# EAGLE schematic Cinesense (EAGLE 9.6.2)
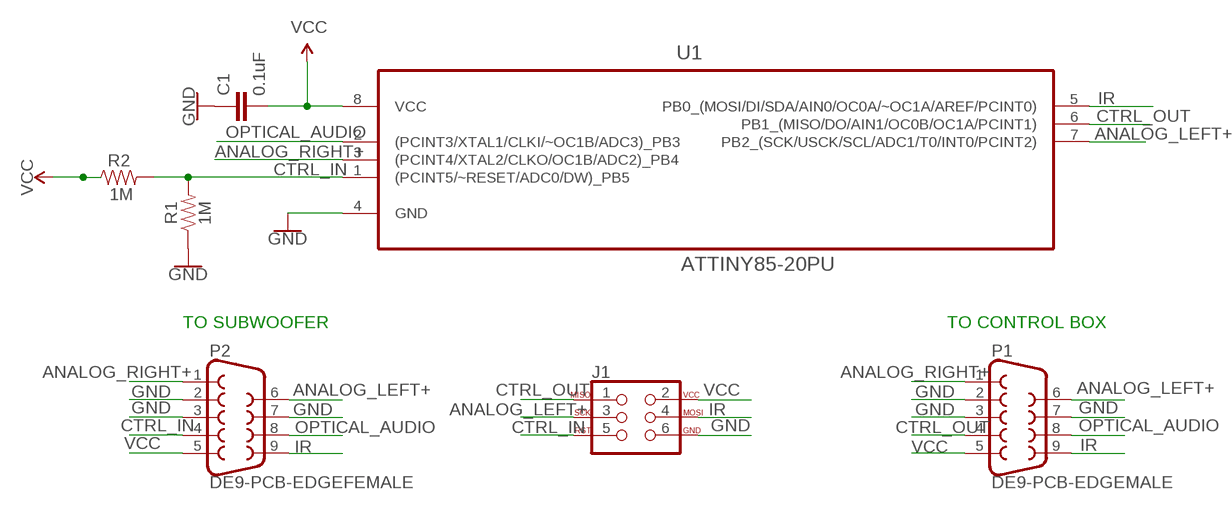
[diagram p0: schematic, sheet 1]

## Parts
C1  0.1uF  0.1UF-KIT-EZ-50V-20%  [CAP-PTH-SMALL-KIT]
J1  AVR_SPI_PROG_3X2PTH  [2X3]
P1  DE9-PCB-EDGEMALE  [DE9-EDGE-M]
P2  DE9-PCB-EDGEFEMALE  [DE9-EDGE-F]
R1  1M  RESISTORAXIAL-0.3  [AXIAL-0.3]
R2  1M  RESISTORAXIAL-0.3  [AXIAL-0.3]
U1  ATTINY85-20PU  [DIP254P762X533-8]

## Nets
ANALOG_LEFT+: J1.3 P1.6 P2.6 U1.7(PB2_(SCK/USCK/SCL/ADC1/T0/INT0/PCINT2))
ANALOG_RIGHT+: P1.1 P2.1 U1.3((PCINT4/XTAL2/CLKO/OC1B/ADC2)_PB4)
CTRL_IN: J1.5 P2.4 R1.P$2 R2.P$2 U1.1((PCINT5/~RESET/ADC0/DW)_PB5)
CTRL_OUT: J1.1 P1.4 U1.6(PB1_(MISO/DO/AIN1/OC0B/OC1A/PCINT1))
GND: C1.1 J1.6 P1.2 P1.3 P1.7 P2.2 P2.3 P2.7 R1.P$1 U1.4(GND)
IR: J1.4 P1.9 P2.9 U1.5(PB0_(MOSI/DI/SDA/AIN0/OC0A/~OC1A/AREF/PCINT0))
OPTICAL_AUDIO: P1.8 P2.8 U1.2((PCINT3/XTAL1/CLKI/~OC1B/ADC3)_PB3)
VCC: C1.2 J1.2 P1.5 P2.5 R2.P$1 U1.8(VCC)

## Notes on the sheet
- TO SUBWOOFER | TO CONTROL BOX

## Library data of the parts
C1 = SparkFun-Capacitors:0.1UF: 0.1µF ceramic capacitors A capacitor is a passive two-terminal electrical component used to store electrical energy temporarily in an electric field.; PROD_ID: CAP-08370
J1 = SparkFun-Connectors:AVR_SPI_PROG_3X2: AVR ISP 6 Pin This is the reduced ISP connector for AVR programming. Common on Arduino. This footprint will take up less PCB space and can be used with a 10-pin to 6-pin adapter such as SKU: BOB-08508 **Special note about "TEST_POINT" package. The stop mask is on the top side, so if you want your programming test points to be on the bottom of your board, make sure to place this package on the bottom side of the board. This also ensure that the orientation to program from the bottom side will be correct. SparkFun Products: SparkFun ISP Pogo Adapter <https://www.sparkfun.com/products/11591> - NS Tiny AVR Programmer <https://www.sparkfun.com/products/11801> -PTH
P1 P2 = WackyJay:DE9-PCB-EDGE: DB9 serial connector mounted on the edge of a PCB. Solder cup style connectors work best.
R1 R2 = SparkFun-Resistors:RESISTOR: Generic Resistor Package
U1 = ATTINY85-20PU:ATTINY85-20PU: 8-bit Microcontroller with In-System Programmable Flash; AVAILABILITY: Unavailable; DESCRIPTION: ATtiny Series 20 MHz 8 KB Flash 512 B SRAM 8-Bit Microcontroller - DIP-8; MF: Microchip; MP: ATTINY85-20PU; PACKAGE: DIP-8 Microchip; PRICE: None